# Altium schematic sheet 44_GE_PORT_1-2.SchDoc
size 419 x 296 mm; Author: Serbinov O.A.; CompanyName: ELSICOM; DrawnBy: Serbinov O.A.; Engineer: Serbinov O.A.; Organization: Elsicom; Address1: Kirova avenue, 58; Address2: Tomsk; Address3: Russia 634012; ProjectName: 48_PORTS
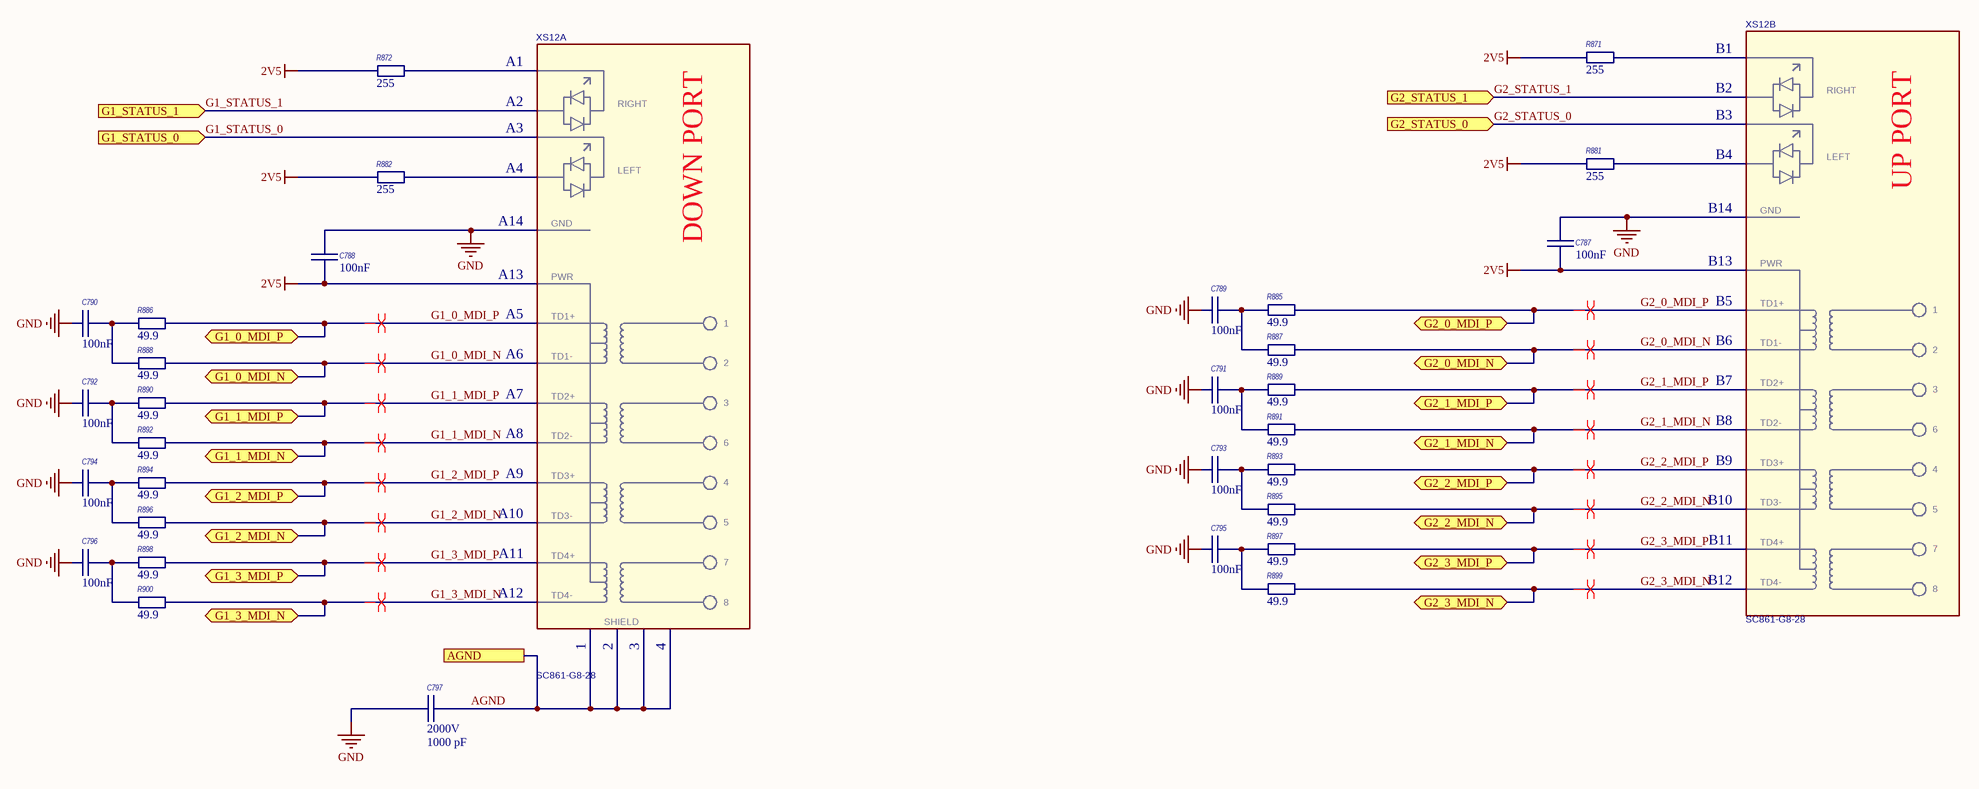
[diagram p0: 44_GE_PORT_1-2.SchDoc]

## Parts
C787  Capacitance: 100nF  [C0402_IPC High Density]  (hidden comment: GRM155R71E104KE14D)
C788  Capacitance: 100nF  [C0402_IPC High Density]  (hidden comment: GRM155R71E104KE14D)
C789  Capacitance: 100nF  [C0402_IPC High Density]  (hidden comment: GRM155R71E104KE14D)
C790  Capacitance: 100nF  [C0402_IPC High Density]  (hidden comment: GRM155R71E104KE14D)
C791  Capacitance: 100nF  [C0402_IPC High Density]  (hidden comment: GRM155R71E104KE14D)
C792  Capacitance: 100nF  [C0402_IPC High Density]  (hidden comment: GRM155R71E104KE14D)
C793  Capacitance: 100nF  [C0402_IPC High Density]  (hidden comment: GRM155R71E104KE14D)
C794  Capacitance: 100nF  [C0402_IPC High Density]  (hidden comment: GRM155R71E104KE14D)
C795  Capacitance: 100nF  [C0402_IPC High Density]  (hidden comment: GRM155R71E104KE14D)
C796  Capacitance: 100nF  [C0402_IPC High Density]  (hidden comment: GRM155R71E104KE14D)
C797  Voltage Rating: 2000V  Capacitance: 1000 pF  [C1808]  (hidden comment: GR442QR73D102KW01L)
R871  Resistance (Ohms): 255  [RESC1005[0402]]  (hidden comment: ERJ-2RKF2550X)
R872  Resistance (Ohms): 255  [RESC1005[0402]]  (hidden comment: ERJ-2RKF2550X)
R881  Resistance (Ohms): 255  [RESC1005[0402]]  (hidden comment: ERJ-2RKF2550X)
R882  Resistance (Ohms): 255  [RESC1005[0402]]  (hidden comment: ERJ-2RKF2550X)
R885  Resistance: 49.9  [R0402_IPC High Density]  (hidden comment: ERJ-2RKF49R9X)
R886  Resistance: 49.9  [R0402_IPC High Density]  (hidden comment: ERJ-2RKF49R9X)
R887  Resistance: 49.9  [R0402_IPC High Density]  (hidden comment: ERJ-2RKF49R9X)
R888  Resistance: 49.9  [R0402_IPC High Density]  (hidden comment: ERJ-2RKF49R9X)
R889  Resistance: 49.9  [R0402_IPC High Density]  (hidden comment: ERJ-2RKF49R9X)
R890  Resistance: 49.9  [R0402_IPC High Density]  (hidden comment: ERJ-2RKF49R9X)
R891  Resistance: 49.9  [R0402_IPC High Density]  (hidden comment: ERJ-2RKF49R9X)
R892  Resistance: 49.9  [R0402_IPC High Density]  (hidden comment: ERJ-2RKF49R9X)
R893  Resistance: 49.9  [R0402_IPC High Density]  (hidden comment: ERJ-2RKF49R9X)
R894  Resistance: 49.9  [R0402_IPC High Density]  (hidden comment: ERJ-2RKF49R9X)
R895  Resistance: 49.9  [R0402_IPC High Density]  (hidden comment: ERJ-2RKF49R9X)
R896  Resistance: 49.9  [R0402_IPC High Density]  (hidden comment: ERJ-2RKF49R9X)
R897  Resistance: 49.9  [R0402_IPC High Density]  (hidden comment: ERJ-2RKF49R9X)
R898  Resistance: 49.9  [R0402_IPC High Density]  (hidden comment: ERJ-2RKF49R9X)
R899  Resistance: 49.9  [R0402_IPC High Density]  (hidden comment: ERJ-2RKF49R9X)
R900  Resistance: 49.9  [R0402_IPC High Density]  (hidden comment: ERJ-2RKF49R9X)
XS12  SC861-G8-28  [SC861-G8-28]  (parts A,B of 2)

## Ports
AGND, G1_0_MDI_N (bidir), G1_0_MDI_P (bidir), G1_1_MDI_N (bidir), G1_1_MDI_P (bidir), G1_2_MDI_N (bidir), G1_2_MDI_P (bidir), G1_3_MDI_N (bidir), G1_3_MDI_P (bidir), G1_STATUS_0 (in), G1_STATUS_1 (in), G2_0_MDI_N (bidir), G2_0_MDI_P (bidir), G2_1_MDI_N (bidir), G2_1_MDI_P (bidir), G2_2_MDI_N (bidir), G2_2_MDI_P (bidir), G2_3_MDI_N (bidir), G2_3_MDI_P (bidir), G2_STATUS_0 (in), G2_STATUS_1 (in)

## Nets
2V5: C787.2 C788.2 R871.1 R872.1 R881.1 R882.1 XS12.A13 XS12.B13
GND: C787.1 C788.1 C789.1 C790.1 C791.1 C792.1 C793.1 C794.1 C795.1 C796.1 C797.1 XS12.A14 XS12.B14
AGND: C797.2 XS12.1 XS12.2 XS12.3 XS12.4 ; port AGND
G1_0_MDI_N: R888.2 XS12.A6 ; port G1_0_MDI_N
G1_0_MDI_P: R886.2 XS12.A5 ; port G1_0_MDI_P
G1_1_MDI_N: R892.2 XS12.A8 ; port G1_1_MDI_N
G1_1_MDI_P: R890.2 XS12.A7 ; port G1_1_MDI_P
G1_2_MDI_N: R896.2 XS12.A10 ; port G1_2_MDI_N
G1_2_MDI_P: R894.2 XS12.A9 ; port G1_2_MDI_P
G1_3_MDI_N: R900.2 XS12.A12 ; port G1_3_MDI_N
G1_3_MDI_P: R898.2 XS12.A11 ; port G1_3_MDI_P
G1_STATUS_0: XS12.A3 ; port G1_STATUS_0
G1_STATUS_1: XS12.A2 ; port G1_STATUS_1
G2_0_MDI_N: R887.2 XS12.B6 ; port G2_0_MDI_N
G2_0_MDI_P: R885.2 XS12.B5 ; port G2_0_MDI_P
G2_1_MDI_N: R891.2 XS12.B8 ; port G2_1_MDI_N
G2_1_MDI_P: R889.2 XS12.B7 ; port G2_1_MDI_P
G2_2_MDI_N: R895.2 XS12.B10 ; port G2_2_MDI_N
G2_2_MDI_P: R893.2 XS12.B9 ; port G2_2_MDI_P
G2_3_MDI_N: R899.2 XS12.B12 ; port G2_3_MDI_N
G2_3_MDI_P: R897.2 XS12.B11 ; port G2_3_MDI_P
G2_STATUS_0: XS12.B3 ; port G2_STATUS_0
G2_STATUS_1: XS12.B2 ; port G2_STATUS_1
NetC789_2: C789.2 R885.1 R887.1
NetC790_2: C790.2 R886.1 R888.1
NetC791_2: C791.2 R889.1 R891.1
NetC792_2: C792.2 R890.1 R892.1
NetC793_2: C793.2 R893.1 R895.1
NetC794_2: C794.2 R894.1 R896.1
NetC795_2: C795.2 R897.1 R899.1
NetC796_2: C796.2 R898.1 R900.1
NetR871_2: R871.2 XS12.B1
NetR872_2: R872.2 XS12.A1
NetR881_2: R881.2 XS12.B4
NetR882_2: R882.2 XS12.A4

Not connected (* = marked no-connect by the designer): XS12 113 114 115 116 117 118 119 120 121

## Layout directives
differential pair: G1_0_MDI_N, G1_0_MDI_P, G1_1_MDI_N, G1_1_MDI_P, G1_2_MDI_N, G1_2_MDI_P, G1_3_MDI_N, G1_3_MDI_P, G2_0_MDI_N, G2_0_MDI_P, G2_1_MDI_N, G2_1_MDI_P, G2_2_MDI_N, G2_2_MDI_P, G2_3_MDI_N, G2_3_MDI_P

## Notes on the sheet
- A3
- SIZE
- PROJECT
- SHEET
- OF
- Engineer: Oleg Serbinov
- (in symbol SC861-G8-28, part A) RIGHT; LEFT; GND; DOWN PORT; PWR; TD1+; TD1-; TD2+; TD2-; 6; TD3+; TD3-; 5; TD4+; 7; TD4-; 8; SHIELD
- (in symbol SC861-G8-28, part B) RIGHT; LEFT; UP PORT; GND; PWR; TD1+; TD1-; TD2+; TD2-; 6; TD3+; TD3-; 5; TD4+; 7; TD4-; 8

## Library data of the parts
C787-C796 = GRM155R71E104KE14D: C0402, 100nF, 25V, X7R; Manufacturer: Murata; Rmanufacturer: Yageo  Samsung  TDK  Taiyo Yuden  Kemet; Customer Part Number: Конденсатор, 100n, 0402, 25V, X7R, 10%; Capacitance Tolerance: ± 10%; Voltage Rating: 16; Capacitor Case Style: 0402 [1005 Metric]; Capacitor Terminals: SMD; SVHC: No SVHC (19-Dec-2012); No. of Pins: 2; Reel Quantity: 10000; Tolerance +: 10%; Analogs: any suitable; Manufacturer Part Number: GRM155R71E104KE14D; RoHS: YES; Packaging: Reel; Package / Case: 0402; ComponentLink1URL: http://www.farnell.com/datasheets/4360.pdf; ComponentLink1Description: http://www.farnell.com/datasheets/4360.pdf; Pricing: 10000=0.008593, 30000=0.007991 (GBP); Supplier 1: Farnell; Supplier Part Number 1: 1118151; Stock: 3; Dielectric Characteristic: X7R; Operating Temperature Min: -55; Operating Temperature Max: 125; Operating Temperature Range: -55°C to +125; Series: GRM Hi-Cap; Terminal Type: Surface Mount (SMD, SMT); Tolerance -: 10%; Voltage Rating V DC: 16
C797 = GR442QR73D102KW01L: C1808, 2KV 1000pF, X7R; Manufacturer: Murata; Rpart number: 202R29W102KV4E ; CL42B102KJFNNNE ; C4520X7R3D102K130KA ; 1808GC102KAT1A; Rmanufacturer: Yageo  Samsung  TDK  Taiyo Yuden  Kemet; Customer Part Number: Конденсатор, 1n, 1808, 2000V, X7R, 10%; Tolerance: 10 %; Temperature Coefficient / Code: 15 %; Analogs: any suitable; Operating Temperature Range: - 55 C to + 125 C; Product Category: Low & Medium Capacitance SMD Ceramic Chip Capacitors; Reeling: True; Manufacturer Part Number: GR442QR73D102KW01L; Minimum Order Quantity: 1; Dimensions: 2 mm W x 4.5 mm L x 1.5 mm H; Series: GR4; Standard Pack Qty: 2000; RoHS: RoHS Compliant By Exemption; Supplier Part Number: 81-GR442QR73D102KW01; Termination Style: SMD/SMT; Packaging: Reel; Supplier: Mouser; Product: General Type MLCCs; Category: Multilayer Ceramic Capacitors (MLCC) - SMD/SMT; RoHS - Mouser: E; Pricing: 1=0.648, 50=0.513, 100=0.420, 500=0.300, 1000=0.239, 2000=0.203, 4000=0.170, 8000=0.154, 12000=0.139 (AUD); ComponentLink1URL: http://www.murata.com/products/catalog/pdf/c02e.pdf; ComponentLink1Description: http://www.murata.com/products/catalog/pdf/c02e.pdf
R871 R872 R881 R882 = ERJ-2RKF2550X: R0402, 255R 1%; Manufacturer: Panasonic; Customer Part Number: Резистор, 255R, 0402, 1%; Temperature Coefficient: ±100ppm/°C; Power (Watts): 0.1W, 1/10W; Analogs: any suitable; Category: Resistors; Supplier: Digi-Key; Supplier Part Number: P255LDKR-ND; RoHS: RoHS Compliant; Manufacturer Part Number: ERJ-2RKF2550X; Packaging: Digi-Reel®; Composition: Thick Film; Number of Terminations: 2; Height: 0.016" (0.40mm); Size / Dimension: 0.039" L x 0.020" W (1.00mm x 0.50mm); Tolerance: ±1%; Features: -; Package / Case: 0402 (1005 Metric); ComponentLink1URL: http://industrial.panasonic.com/www-cgi/jvcr13pz.cgi?E+PZ+3+AOA0002+ERJ2RKF2550X+7+WW; ComponentLink1Description: http://industrial.panasonic.com/www-cgi/jvcr13pz.cgi?E+PZ+3+AOA0002+ERJ2RKF2550X+7+WW; Pricing: 1=0.1, 50=0.0242, 100=0.0184, 250=0.01364, 500=0.01008, 1000=0.00672, 5000=0.00473 (USD)
R885-R900 = ERJ-2RKF49R9X: R0402, 49.9R 1%; Manufacturer: Panasonic; Rpart number: RC0402FR-0749R9L ; RC1005F49R9CS ; MCR01MRTF49R9 ; CRCW040249R9FKED ; CR0402-FX-49R9GLF; Rmanufacturer: Yageo  Samsung  Stackpole Electronics  Rohm Semiconductor  Vishay Dale; Customer Part Number: Резистор, 49R9, 0402, 1%; Temperature Coefficient: 100 PPM / C; Voltage Rating: 50 Volts; Power Rating: 100 mWatts; Analogs: any suitable; Category: Thick Film Resistors - SMD; Supplier: Mouser; Supplier Part Number: 667-ERJ-2RKF49R9X; Manufacturer Part Number: ERJ-2RKF49R9X; Product Category: .; Minimum Order Quantity: 1; Series: ERJ; Product: Thick Film Resistors SMD; RoHS - Mouser: E; Reeling: True; Packaging: Reel; Termination Style: SMD/SMT; Package / Case: 0402 (1005 metric); Standard Pack Qty: 10000; Tolerance: 1 %; Operating Temperature Range: - 55 C to + 155 C; RoHS: RoHS Compliant By Exemption; Dimensions: 0.5 mm W x 1 mm L x 0.35 mm H; ComponentLink1URL: http://industrial.panasonic.com/www-data/pdf/AOA0000/AOA0000CE2.pdf; ComponentLink1Description: http://industrial.panasonic.com/www-data/pdf/AOA0000/AOA0000CE2.pdf; Pricing: 1=0.135, 25=0.032, 100=0.024, 250=0.018, 500=0.014, 1000=0.008, 2000=0.007, 5000=0.004 (AUD)
XS12 = SC861-G8-28: Connector RJ45 1G 2 ports (2*1) and LED; Customer Part Number: Разъем, SC861-G8-28, Connector RJ45 1G 2 ports (2*1) and LED; Manufacturer: Yueqing Shichuang Electronics; Analogs: 9812G-81015-S3LXT45-D; Manufacturer Part Number: SC861-G8-28